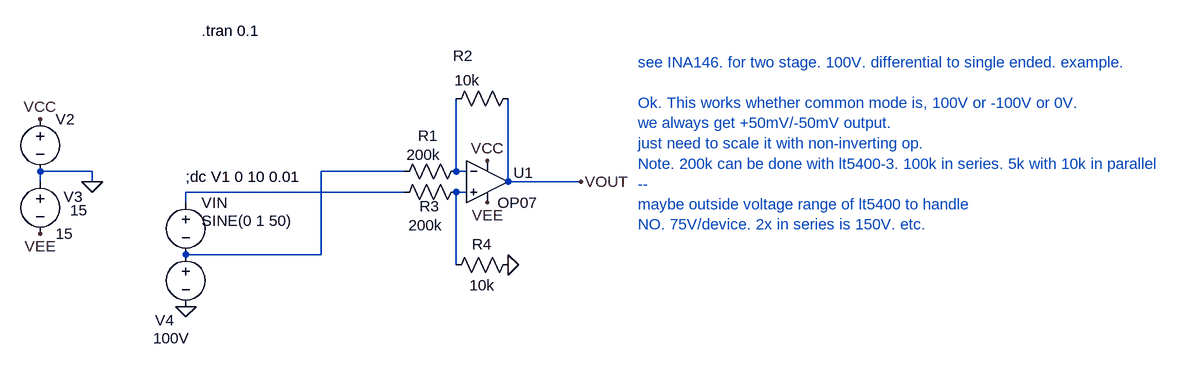
[diagram p0: schematic Draft11.asc]
Draft11.asc, the LTspice schematic file:
Version 4
SHEET 1 1588 680
WIRE -192 80 -272 80
WIRE 288 80 160 80
WIRE 368 80 368 -32
WIRE 384 80 368 80
WIRE -272 96 -272 80
WIRE -192 96 -192 80
WIRE 448 96 448 -32
WIRE 560 96 448 96
WIRE 288 112 -48 112
WIRE 384 112 368 112
WIRE -48 128 -48 112
WIRE 160 208 160 80
WIRE 160 208 -48 208
WIRE 368 224 368 112
FLAG -192 96 0
FLAG 560 96 VOUT
FLAG -48 288 0
FLAG 448 224 0
FLAG -272 0 VCC
FLAG 416 64 VCC
FLAG -272 176 VEE
FLAG 416 128 VEE
SYMBOL voltage -48 112 R0
WINDOW 123 0 0 Left 0
WINDOW 39 0 0 Left 0
WINDOW 3 24 44 Left 2
SYMATTR Value SINE(0 1 50)
SYMATTR InstName VIN
SYMBOL OpAmps\\OP07 416 32 R0
WINDOW 0 40 50 Left 2
SYMATTR InstName U1
SYMBOL voltage -272 -16 R0
WINDOW 123 0 0 Left 0
WINDOW 39 0 0 Left 0
WINDOW 3 46 156 Left 2
SYMATTR Value 15
SYMATTR InstName V2
SYMBOL voltage -272 80 R0
WINDOW 123 0 0 Left 0
WINDOW 39 0 0 Left 0
WINDOW 0 36 39 Left 2
SYMATTR InstName V3
SYMATTR Value 15
SYMBOL res 384 64 R90
WINDOW 0 -23 59 VBottom 2
WINDOW 3 -25 66 VTop 2
SYMATTR InstName R1
SYMATTR Value 200k
SYMBOL res 464 -48 R90
WINDOW 0 -34 85 VBottom 2
WINDOW 3 -28 79 VTop 2
SYMATTR InstName R2
SYMATTR Value 10k
SYMBOL voltage -48 192 R0
WINDOW 0 -47 117 Left 2
WINDOW 3 -50 145 Left 2
WINDOW 123 0 0 Left 0
WINDOW 39 0 0 Left 0
SYMATTR InstName V4
SYMATTR Value 100V
SYMBOL res 384 96 R90
WINDOW 0 53 57 VBottom 2
WINDOW 3 51 63 VTop 2
SYMATTR InstName R3
SYMATTR Value 200k
SYMBOL res 464 208 R90
WINDOW 0 0 56 VBottom 2
WINDOW 3 32 56 VTop 2
SYMATTR InstName R4
SYMATTR Value 10k
TEXT -48 88 Left 2 !;dc V1 0 10 0.01
TEXT -24 -136 Left 2 !.tran 0.1
TEXT 648 -88 Left 2 ;see INA146. for two stage. 100V. differential to single ended. example.\n \nOk. This works whether common mode is, 100V or -100V or 0V. \nwe always get +50mV/-50mV output.\njust need to scale it with non-inverting op.\nNote. 200k can be done with lt5400-3. 100k in series. 5k with 10k in parallel\n--\nmaybe outside voltage range of lt5400 to handle\nNO. 75V/device. 2x in series is 150V. etc.

The netlist it stands for:
* Draft11.asc
VIN N003 N001 SINE(0 1 50)
XU1 N004 N002 VCC VEE VOUT LT1001  ; OP07, pins In+ In- V+ V- OUT
V2 VCC 0 15
V3 0 VEE 15
R1 N002 N001 200k
R2 VOUT N002 10k
V4 N001 0 100V
R3 N004 N003 200k
R4 0 N004 10k
;dc V1 0 10 0.01
.tran 0.1
* see INA146. for two stage. 100V. differential to single ended. example.
* Ok. This works whether common mode is, 100V or -100V or 0V.
* we always get +50mV/-50mV output.
* just need to scale it with non-inverting op.
* Note. 200k can be done with lt5400-3. 100k in series. 5k with 10k in parallel
* --
* maybe outside voltage range of lt5400 to handle
* NO. 75V/device. 2x in series is 150V. etc.
.lib LTC.lib
.backanno
.end